# Altium project ECEN_403_Power_Circuit.PrjPcb
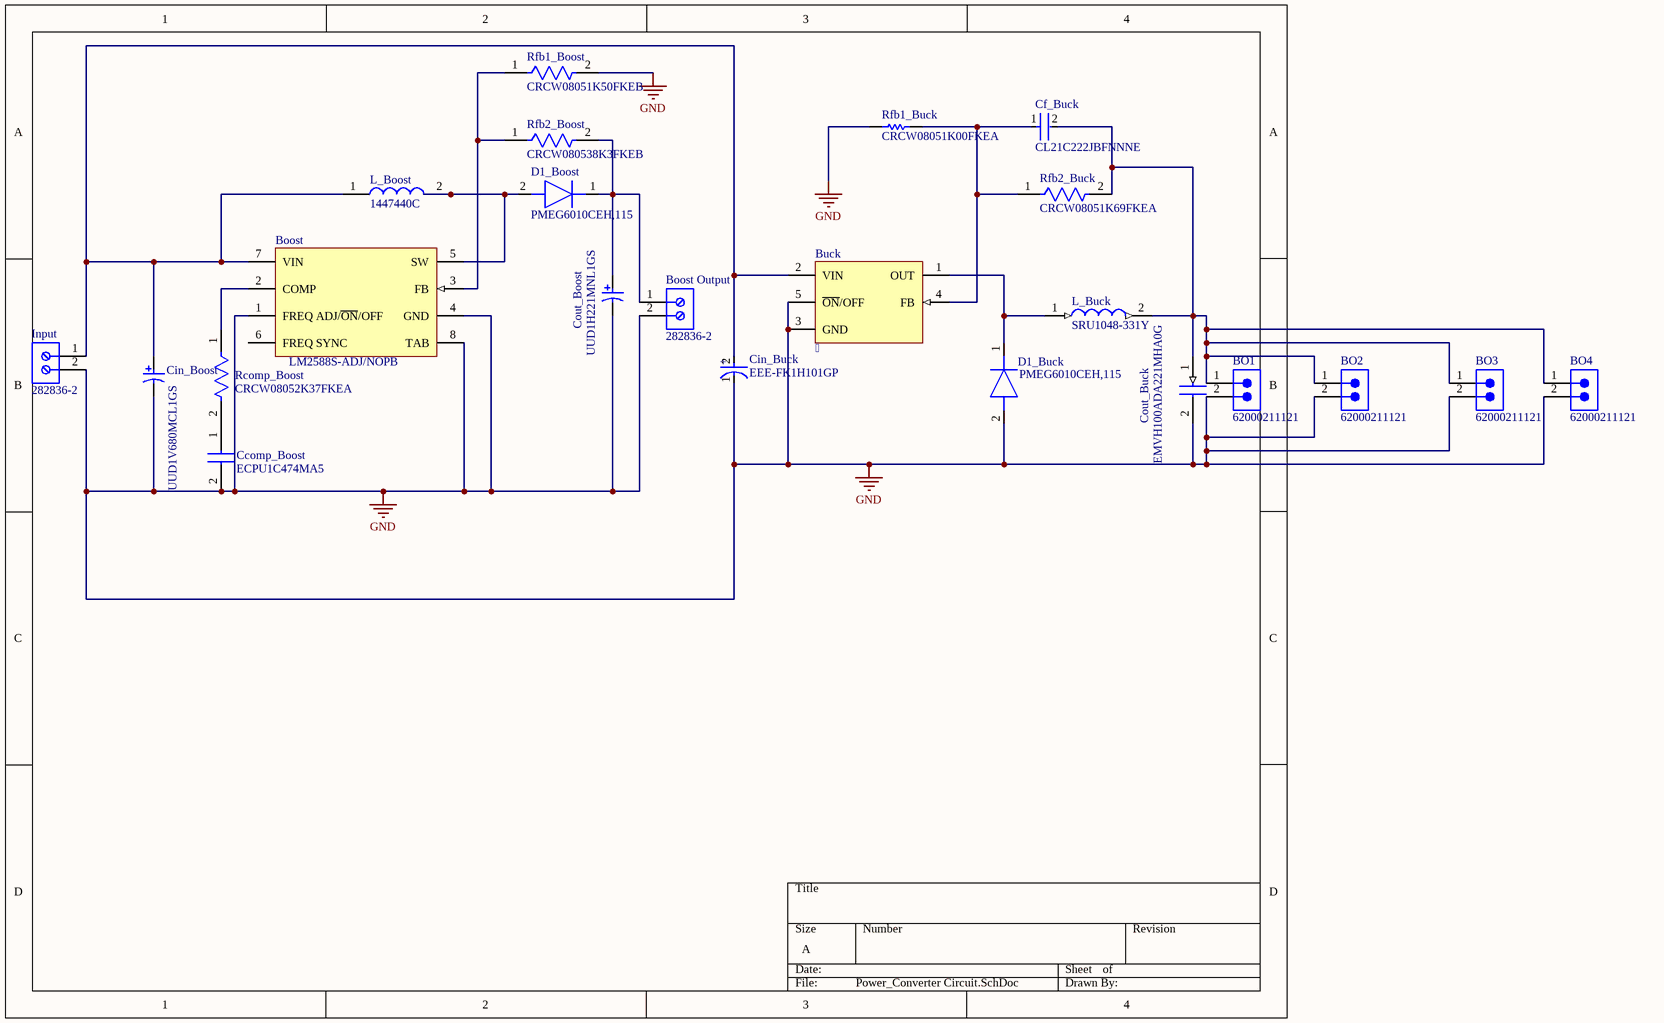
[diagram p0: Power_Converter Circuit.SchDoc]
1 sheet, 23 parts. Net scope: global (net labels, ports and power ports of the same name join across sheets).
Board file: Power_Converter.PcbDoc

## Sheet Power_Converter Circuit.SchDoc
size A; SheetNumber: 1; SheetTotal: 1

### Parts
BO1  62000211121  [62000211121]
BO2  62000211121  [62000211121]
BO3  62000211121  [62000211121]
BO4  62000211121  [62000211121]
Boost  LM2588S-ADJ/NOPB  [KTW0007B_N]
Boost_Output  282836-2  [TECO-282836-2_V]
Buck    [NDH0005A]
Ccomp_Boost  ECPU1C474MA5  [ECPU1C154MA5]
Cf_Buck  CL21C222JBFNNNE  [FP-CL21-IPC_C]
Cin_Boost  UUD1V680MCL1GS  [NIC-CAPA2-6.3X7.7_V]
Cin_Buck  EEE-FK1H101GP  [FP-FKF-MFG]
Cout_Boost  UUD1H221MNL1GS  [NIC-CAPA2-10X10_V]
Cout_Buck  EMVH100ADA221MHA0G  [CAPAE830X1050N]
D1_Boost  PMEG6010CEH,115  [SODFL3516X120N]
D1_Buck  PMEG6010CEH,115  [SODFL3516X120N]
Input  282836-2  [TECO-282836-2_V]
L_Boost  1447440C  [1447440C]
L_Buck  SRU1048-331Y  [INDPM100100X510N]
Rcomp_Boost  CRCW08052K37FKEA  [FP-CRCW0805-e3-IPC_C]
Rfb1_Boost  CRCW08051K50FKEB  [FP-CRCW0805-e3-IPC_C]
Rfb1_Buck  CRCW08051K00FKEA  [RESC2013X50X30NL20T20]
Rfb2_Boost  CRCW080538K3FKEB  [FP-CRCW0805-e3-MFG]
Rfb2_Buck  CRCW08051K69FKEA  [FP-CRCW0805-e3-IPC_A]

### Nets
GND: BO1.2 BO2.2 BO3.2 BO4.2 Boost.1(FREQ_ADJ/~{ON}/OFF) Boost.4(GND) Boost.8(TAB) Boost_Output.2 Buck.3(GND) Buck.5(~{ON}/OFF) Ccomp_Boost.2 Cin_Boost.2 Cin_Buck.1(C) Cout_Boost.2 Cout_Buck.2(-) D1_Buck.2(A) Input.2 Rfb1_Boost.2 Rfb1_Buck.1
NetBO1_1: BO1.1 BO2.1 BO3.1 BO4.1 Cf_Buck.2 Cout_Buck.1(+) L_Buck.2 Rfb2_Buck.2
NetBoost_2: Boost.2(COMP) Rcomp_Boost.1
NetBoost_3: Boost.3(FB) Rfb1_Boost.1 Rfb2_Boost.1
NetBoost_5: Boost.5(SW) D1_Boost.2(A) L_Boost.2
NetBoost_7: Boost.7(VIN) Buck.2(VIN) Cin_Boost.1 Cin_Buck.2(A) Input.1 L_Boost.1
NetBoost_Output_1: Boost_Output.1 Cout_Boost.1 D1_Boost.1(K) Rfb2_Boost.2
NetBuck_1: Buck.1(OUT) D1_Buck.1(K) L_Buck.1
NetBuck_4: Buck.4(FB) Cf_Buck.1 Rfb1_Buck.2 Rfb2_Buck.1
NetCcomp_Boost_1: Ccomp_Boost.1 Rcomp_Boost.2

Not connected (* = marked no-connect by the designer): Boost 6(FREQ_SYNC)

### Notes on the sheet
- (in symbol CMP-05427-000032-1) +

### Library data of the parts
BO1-BO4 = CMP-1502-00956-3: NexarPartId: 61924778; Number of Contacts: 2; Voltage Rating: 200V; Gender: Male; Contact Resistance: 20mΩ; Current Rating: 2A; Lead Pitch: 2mm; Max Operating Temperature: 105°C; Contact Material: Gold; Number of Rows: 1; Operating Supply Voltage: 200V; Number of Pins: 2; Orientation: Vertical; Min Operating Temperature: -40°C; Height: 6.35mm; RoHS: Non-Compliant
Boost = CMP-0069-00054-3: SIMPLE SWITCHER® 5A Flyback Regulator with Shutdown, 7-pin TO-263, Pb-Free; Manufacturer: Texas Instruments; PowerWise: N; PackageTopMarking: NSUZXYTTE#*LM2588S*-ADJ P+; PinCount: 7; PackageReference: KTW0007B; ComponentLink1Description: Datasheet URL; ComponentLink1URL: http://www.ti.com/general/docs/lit/getliterature.tsp?genericPartNumber=LM2588&fileType=pdf; Code_JEDEC: MO-169-AC; RoHS: Y; CompType: Switcher; PackageDescription: TO-263, Molded, .400 x .390 x .180in Body, 7 Lead, .050in Pitch, Surface Mount
Boost_Output Input = CMP-1684-00017-1: Female Header, Pitch 5 mm, 1 x 2 Position, Height 10 mm, Tail Length 3.5 mm, Rohs, Bulk; Manufacturer: TE Connectivity; Wire Gauge: 16-30AWG; Product Training Modules: Wire-to-BoardEurostyleTerminalBlocks; Clamp Material - Plating: Brass-NickelPlated; Voltage: 300V; Mating Orientation: HorizontalwithBoard; Current: 13.5A; Pitch: 0.197"(5.00mm); Screw Thread: M3; 3D Model: 282836-2.pdf; Other Names: 5ULV-02B / A98076; Dynamic Catalog: BuchananSeries; Number of Levels: 1; Torque - Screw: 0.68Nm(6Lb-In); Featured Product: EurostyleTerminalBlockConnectors; Positions Per Level: 2; Wire Termination: Screw-RisingCageClamp; Datasheet URL: http://www.te.com.cn/commerce/DocumentDelivery/DDEController?Action=showdoc&DocId=Catalog+Section%7F1308389_EUROSTYLE_TERMINAL_BLOCKS%7F0607%7Fpdf%7FEnglish%7FENG_CS_1308389_EUROSTYLE_TERMINAL_BLOCKS_0607.pdf%7F282836-2; Color: Green; Family: TerminalBlocks-WiretoBoard; RoHS Information: 282836-2StatementofCompliance; Standard Package: 300; Contact Material - Plating: Brass-TinPlated; Manufacturer URL: http://www.te.com; Housing Material: Polyamide(PA66),Nylon6/6; Features: Interlocking(Side); Package Description: Female Header, Pitch 5 mm, 1 x 2 Position, Height 10 mm, Tail Length 3.5 mm; Mounting Type: ThroughHole; Package Reference: THD; Packaging: Bulk; Series: Buchanan; Category: Connectors,Interconnects; Screw Material - Plating: Brass-NickelPlated
Buck = CMP-0069-01920-3: SIMPLE SWITCHER® Power Converter 150 KHz 1A Step-Down Voltage Regulator, 5-pin TO-220, Pb-Free; Manufacturer: Texas Instruments; PackageTopMarking: NSUZXYTTE#*LM2595T*-ADJ P+; PowerWise: N; ComponentLink1Description: Datasheet URL; CompType: Switcher; PackageReference: NDH0005A; ComponentLink1URL: http://www.ti.com/general/docs/lit/getliterature.tsp?genericPartNumber=LM2595&fileType=pdf; PackageDescription: TO-220, Molded, Stagger Bend, 5 Lead; RoHS: Y; PinCount: 5
Ccomp_Boost = ECPU1C474MA5: Capacitor; Manufacturer_Name: Panasonic; Datasheet Link: http://industrial.panasonic.com/cdbs/www-data/pdf/RDI0000/ABD0000C178.pdf; Manufacturer_Part_Number: ECPU1C474MA5
Cf_Buck = CMP-13271-001564-1: CL21 Series 0805 2.2nF 50V ±5% Tolerance C0G Multilayer Ceramic Chip Capacitor; Mount: Surface Mount; Packaging: Tape and Reel; Tolerance: 5%; Thickness: 0.053inch; Case Code (Imperial): 0805; Capacitance: 2.2nF; Min Operating Temperature: -55°C; Width: 0.049inch; Package Quantity: 2000; Depth: 1.25mm; Radiation Hardening: No; Voltage Rating (DC): 50V; Case/Package: 0805; Voltage: 50V; Max Operating Temperature: 125°C; Case Code (Metric): 2012; Voltage Rating: 50V; Length: 2mm; Dielectric: C0G; Height: 1.25mm; Lead Free: Lead Free
Cin_Boost = CMP-0687-00064-1: Aluminum Electrolytic Capacitor, UD Series, Low Impedance, 68 uF, 35 V, + / - 20%, -55 to 105 degC, Chip Type, 6.3 x 7.7 mm D x L, Pb-Free, Reel; Manufacturer: Nichicon; Rated Ripple Current (at 100kHz): 280 mA; Rated Capacitance: 68 uF; Impedance: 0.34 Ohm; Rated Voltage: 35 V; Packing: Dia382mm Reel; Endurance Time: 2000 h; Tolerance Rated Capacitance: -20 to 20%; Mounting Technology: Surface Mount; ComponentLink2URL: http://products.nichicon.co.jp/en/pdf/XJA043/e-ud.pdf; ComponentLink1Description: Manufacturer URL; PackageReference: CAPAE-D6.3H7.7; Diameter: 6.3 mm; PackageDescription: 2-Pin Surface Mount Device, Diameter 6.3 mm, Height 7.7 mm, Pitch 5.4 mm; ComponentLink2Description: Datasheet; ComponentLink3Description: Package Specification; RoHS: TRUE; Length: 7.7 mm; DatasheetVersion: 08/2012; ComponentLink1URL: http://www.nichicon.co.jp/; ComponentLink3URL: http://products.nichicon.co.jp/en/pdf/XJA043/e-ud.pdf; PartNumber: UUD1V680MCL1GS
Cin_Buck = CMP-05427-000032-1: CAP ALUM 100UF 20% 50V SMD; Ripple Current (AC): 350mA; Impedance: 340mR; Life (Hours): 5000Hour; Leakage Current: 10mA; Voltage: 50V; Voltage Rating (DC): 50V; ESR (Equivalent Series Resistance): 340mR; Packaging: Tape and Reel; Radiation Hardening: No; Construction: Cylindrical; Case/Package: SMD/SMT; Contact Plating: Tin; Min Operating Temperature: -55°C; Lead Free: Lead Free; Mount: Surface Mount; Number of Pins: 2; Height: 10.2mm; Tolerance: 20%; Package Quantity: 1; Voltage Rating: 50V; Termination: SMD/SMT; Width: 10mm; Max Operating Temperature: 105°C; Height - Seated (Max): 0.402inch; RoHS Compliant: Yes; Ripple Current: 350mA; Length: 10.2mm; Capacitance: 100uF; Series: FK; REACH SVHC: No SVHC; Diameter: 8mm
Cout_Boost = CMP-0687-00004-1: Aluminum Electrolytic Capacitor, UD Series, Low Impedance, 220 uF, 50 V, + / - 20%, -55 to 105 degC, Chip Type, 10 x 10 mm D x L, Pb-Free, Reel; Manufacturer: Nichicon; Rated Capacitance: 220 uF; Packing: Dia382mm Reel; Endurance Time: 5000 h; Rated Ripple Current (at 100kHz): 670 mA; Tolerance Rated Capacitance: -20 to 20%; Rated Voltage: 50 V; Impedance: 0.18 Ohm; RoHS: TRUE; ComponentLink2URL: http://products.nichicon.co.jp/en/pdf/XJA043/e-ud.pdf; PartNumber: UUD1H221MNL1GS; ComponentLink3URL: http://products.nichicon.co.jp/en/pdf/XJA043/e-ud.pdf; Mounting Technology: Surface Mount; ComponentLink1Description: Manufacturer URL; ComponentLink3Description: Package Specification; ComponentLink1URL: http://www.nichicon.co.jp/; Diameter: 10 mm; PackageDescription: 2-Pin Surface Mount Device, Diameter 10 mm, Height 10 mm, Pitch 8 mm; PackageReference: CAPAE-D10H10; ComponentLink2Description: Datasheet; DatasheetVersion: 08/2012; Length: 10 mm
Cout_Buck = EMVH100ADA221MHA0G: Capacitor; Manufacturer_Name: Chemi-Con; Datasheet Link: https://www.mouser.com/datasheet/2/420/MVHRA_e-2509159.pdf; Height: 10.5mm; Manufacturer_Part_Number: EMVH100ADA221MHA0G
D1_Boost D1_Buck = PMEG6010CEH,115: Diode; Manufacturer_Name: Nexperia; Datasheet Link: https://assets.nexperia.com/documents/data-sheet/PMEG6010CEH_PMEG6010CEJ.pdf; Height: 1.2mm; Manufacturer_Part_Number: PMEG6010CEH,115; Mouser Part Number: 771-PMEG6010CEH-T/R; Mouser Price/Stock: https://www.mouser.co.uk/ProductDetail/Nexperia/PMEG6010CEH115?qs=LOCUfHb8d9uyulDQGIpcOA%3D%3D; Arrow Part Number: PMEG6010CEH,115; Arrow Price/Stock: https://www.arrow.com/en/products/pmeg6010ceh115/nexperia?region=europe
L_Boost = 1447440C: Inductor; Manufacturer_Name: Murata Electronics; Datasheet Link: https://www.arrow.com/en/products/1447440c/murata-power-solutions; Manufacturer_Part_Number: 1447440C; Mouser Part Number: 580-1447440C; Mouser Price/Stock: https://www.mouser.co.uk/ProductDetail/Murata-Power-Solutions/1447440C?qs=Gob89d8LFA9gyjWpYAyVrg%3D%3D; Arrow Part Number: 1447440C; Arrow Price/Stock: https://www.arrow.com/en/products/1447440c/murata-power-solutions
L_Buck = SRU1048-331Y: Inductor; Manufacturer_Name: Bourns; Datasheet Link: http://uk.rs-online.com/web/p/products/1729735; Height: 5.1mm; Manufacturer_Part_Number: SRU1048-331Y
Rcomp_Boost = CMP-1013-00550-3: RES Thick Film, 2.37kΩ, 1%, 0.125W, 100ppm/°C, 0805; Power Rating: 125mW; Voltage Rating: 150V; Resistance: 2.37kR; Max Power Dissipation: 125mW; Contact Plating: Tin; Temperature Coefficient: 100ppm/°C; Case/Package: 0805; Features: Automotive AEC-Q200; Case Code (Metric): 2012; Max Operating Temperature: 155°C; Termination: SMD/SMT; Height: 0.45mm; Weight: 0.000194oz; Case Code (Imperial): 0805; Radiation Hardening: No; Military Standard: Not; Tolerance: 1%; Width: 1.25mm; Depth: 1.25mm; Packaging: Tape and Reel; Length: 2mm; Composition: Thick Film; Number of Terminations: 2; Package Quantity: 10; Min Operating Temperature: -55°C
Rfb1_Boost = CMP-2001-04198-2: RES Thick Film, 1.5kΩ, 1%, 0.125W, 100ppm/°C, 0805; Voltage Rating: 150V; Resistance: 1.5kR; Max Power Dissipation: 125mW; Lead Free: Lead Free; Features: Automotive AEC-Q200; Package Quantity: 10000; Temperature Coefficient: 100ppm/°C; Number of Terminations: 2; Composition: Thick Film; Width: 0.049inch; Termination: SMD/SMT; Tolerance: 1%; Max Operating Temperature: 155°C; Height: 0.02inch; Case Code (Imperial): 0805; Weight: 0.000194oz; Case/Package: 0805; Packaging: Tape and Reel; Min Operating Temperature: -55°C; Voltage Rating (DC): 150V; Power Rating: 125mW; Contact Plating: Tin; Radiation Hardening: No; Case Code (Metric): 2012; Length: 0.079inch
Rfb1_Buck = CMP-1013-00510-2: Manufacturer: Vishay Dale; Part Number: CRCW08051K00FKEA
Rfb2_Boost = CMP-02407-003221-1: RES Thick Film, 38.3kΩ, 1%, 0.125W, 100ppm/°C, 0805; Voltage Rating: 150V; Resistance: 38.3kR; Max Power Dissipation: 125mW; Packaging: Tape and Reel; Case Code (Imperial): 0805; Package Quantity: 10000; Temperature Coefficient: 100ppm/°C; Case Code (Metric): 2012; Lead Free: Lead Free; Max Operating Temperature: 155°C; Tolerance: 1%; Composition: Thick Film; Width: 0.049inch; Weight: 0.000194oz; Power Rating: 125mW; Termination: SMD/SMT; Height: 0.02inch; Number of Terminations: 2; Case/Package: 0805; Length: 0.079inch; Min Operating Temperature: -55°C; Features: Automotive AEC-Q200
Rfb2_Buck = CMP-2001-03620-2: RES Thick Film, 1.69kΩ, 1%, 0.125W, 100ppm/°C, 0805; Voltage Rating: 150V; Resistance: 1.69kR; Power Rating: 125mW; Min Operating Temperature: -55°C; Depth: 1.25mm; Case Code (Imperial): 0805; Temperature Coefficient: 100ppm/°C; Lead Free: Lead Free; Military Standard: Not; Package Quantity: 10; Features: Automotive AEC-Q200; Case Code (Metric): 2012; Case/Package: 0805; Packaging: Tape and Reel; Length: 2mm; Composition: Thick Film; Radiation Hardening: No; Tolerance: 1%; Number of Terminations: 2; Height: 0.45mm; Contact Plating: Tin; Max Power Dissipation: 125mW; Weight: 0.000194oz; Voltage Rating (DC): 150V; Width: 1.25mm; Max Operating Temperature: 155°C; Termination: SMD/SMT